# Altium schematic sheet Sheet3.SchDoc
size A; SheetNumber: 1; SheetTotal: 1
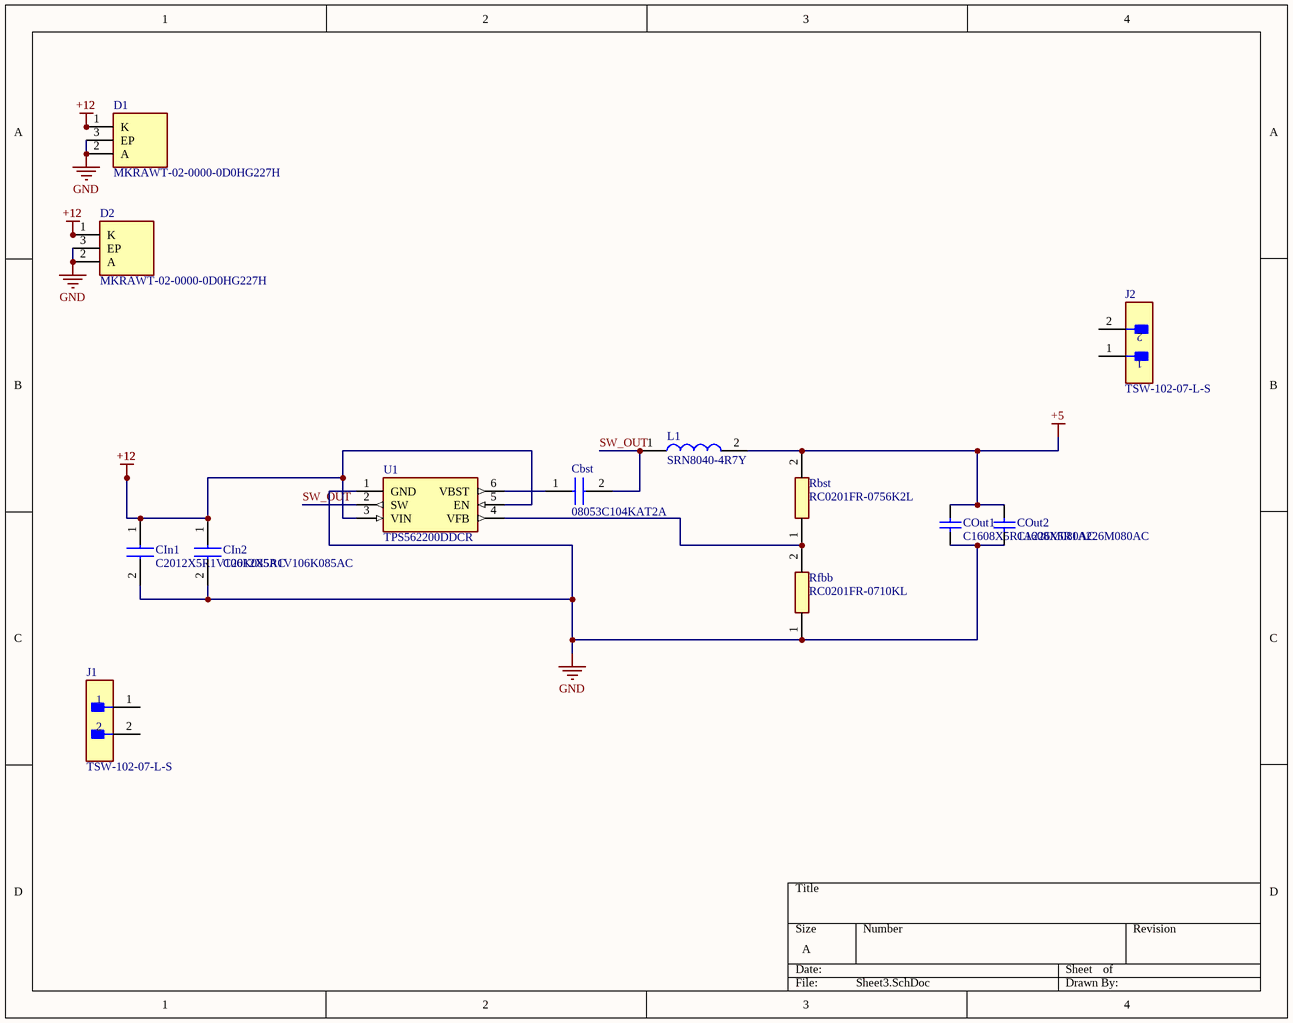
[diagram p0: Sheet3.SchDoc]

## Parts
Cbst  08053C104KAT2A  [CAPC2012X94N]
CIn1  C2012X5R1V106K085AC  [C2012_Commercial]
CIn2  C2012X5R1V106K085AC  [C2012_Commercial]
COut1  C1608X5R1A226M080AC  [CAPC1608X100X20ML10]
COut2  C1608X5R1A226M080AC  [CAPC1608X100X20ML10]
D1  MKRAWT-02-0000-0D0HG227H  [MKRAWT0200000D0HG227H]
D2  MKRAWT-02-0000-0D0HG227H  [MKRAWT0200000D0HG227H]
J1  TSW-102-07-L-S  [FP-TSW-102-07-L-S-MFG]
J2  TSW-102-07-L-S  [FP-TSW-102-07-L-S-MFG]
L1  SRN8040-4R7Y  [SRN80404R7Y]
Rbst  RC0201FR-0756K2L  [RESC0603X26N]
Rfbb  RC0201FR-0710KL  [RESC0603X26N]
U1  TPS562200DDCR  [SOT95P280X110-6N]

## Nets
+5: COut1.2 COut2.2 L1.2 Rbst.2
+12: CIn1.1 CIn2.1 D1.1(K) D2.1(K) U1.3(VIN) U1.5(EN)
GND: CIn1.2 CIn2.2 COut1.1 COut2.1 D1.2(A) D1.3(EP) D2.2(A) D2.3(EP) Rfbb.1 U1.1(GND)
SW_OUT: Cbst.2 L1.1 U1.2(SW)
NetCbst_1: Cbst.1 U1.6(VBST)
NetRbst_1: Rbst.1 Rfbb.2 U1.4(VFB)

Not connected (* = marked no-connect by the designer): J1 1 2; J2 1 2

## Library data of the parts
Cbst = 08053C104KAT2A: Capacitor; Manufacturer_Name: AVX; Datasheet Link: http://datasheets.avx.com/X7RDielectric.pdf; Height: 0.94mm; Manufacturer_Part_Number: 08053C104KAT2A; Mouser Part Number: 581-08053C104K; Mouser Price/Stock: https://www.mouser.co.uk/ProductDetail/AVX/08053C104KAT2A?qs=EihRZLdKnF2GcTBzDkE%2FiQ%3D%3D; Arrow Part Number: 08053C104KAT2A; Arrow Price/Stock: https://www.arrow.com/en/products/08053c104kat2a/avx
CIn1 CIn2 = C2012X5R1V106K085AC: Capacitor; Manufacturer_Name: TDK; Datasheet Link: https://product.tdk.com/system/files/dam/doc/product/capacitor/ceramic/mlcc/catalog/mlcc_commercial_general_en.pdf; Height: 0.75mm; Manufacturer_Part_Number: C2012X5R1V106K085AC; Mouser Part Number: 810-C2012X5R1V106K0C; Mouser Price/Stock: https://www.mouser.co.uk/ProductDetail/TDK/C2012X5R1V106K085AC?qs=6JAMGB%252BEdky%252BlYMcTLhFyA%3D%3D; Arrow Part Number: C2012X5R1V106K085AC; Arrow Price/Stock: https://www.arrow.com/en/products/c2012x5r1v106k085ac/tdk?region=nac
COut1 COut2 = CMP-2000-05441-1: Chip Capacitor, 22 uF, +/- 20%, 10 V, -55 to 85 degC, 0603 (1608 Metric), RoHS, Tape and Reel; Manufacturer: TDK; PCN Part Number: MLCCPartNumberChange30/Nov/2012; Voltage - Rated: 10V; Product Training Modules: CSeriesGeneralApplicationsSEAT,CCV,andTVCLDesignToolsGuidetoReplacinganElectrolyticCapacitorwithanMLCC; Other Names: 445-9077-1; Design Resources: 20WNon-IsolatedBuckLEDDriverUsingPLLNK460KG; Online Catalog: CSeries,GeneralPurpose; Capacitance: 22µF; Temperature Coefficient: X5R; Kits: 445-9014-KIT-ND-KITMLCC100PF-22UF060310-50V; Packaging: CutTape(CT); Standard Package: 1; Package / Case: 0603(1608Metric); Lead Style: -; Features: -; Ratings: -; Operating Temperature: -55degC~85degC; Applications: GeneralPurpose; Package Reference: 603; Datasheet URL: http://download.siliconexpert.com/pdfs/2015/4/21/15/54/45/779/tdk_/manual/37024850441143360mlcc_commercial_general_en.pdf; Datasheet Version: Mar-15; Mounting Type: SurfaceMount,MLCC; Lead Spacing: -; Size / Dimension: 0.063"Lx0.031"W(1.60mmx0.80mm); Height - Seated (Max): -; Package Description: 2-Pin Surface Mount Device, Body 1.6 x 0.8 mm; Manufacturer URL: http://www.tdk.com/; RoHS Information: RoHSCertificate-MLCC; Tolerance: ±20%; Series: C; Thickness (Max): 0.035"(0.90mm); Family: CeramicCapacitors; Category: Capacitors
D1 D2 = MKRAWT-02-0000-0D0HG227H: LED; Manufacturer_Name: CREE LED; Datasheet Link: https://assets.cree-led.com/a/ds/x/XLamp-MKR.pdf; Height: 4.21mm; Manufacturer_Part_Number: MKRAWT-02-0000-0D0HG227H; Mouser Part Number: 941-MKRAWT20D0HG227H; Mouser Price/Stock: https://www.mouser.co.uk/ProductDetail/Cree-LED/MKRAWT-02-0000-0D0HG227H?qs=sVgt%2FnWVh7apRdKowZa3kg%3D%3D
J1 J2 = CMP-02766-001428-1: CONN HEADER VERT 2POS 2.54MM; Voltage Rating: 550V; Current Rating: 7.6A; Gender: Male; Number of Contacts: 2; Connector Type: Male Pin; Radiation Hardening: No; Orientation: Straight; Contact Plating: Gold; Max Operating Temperature: 125°C; Mount: Through Hole; Package Quantity: 1; Number of Rows: 1; Housing Material: Polyester; RoHS Compliant: Yes; Length: 5.08mm; Max Voltage Rating (AC): 550V; Pitch: 2.54mm; Packaging: Bulk; Depth: 2.54mm; Termination: Solder; Min Operating Temperature: -55°C; Housing Color: Black; Lead Free: Lead Free; Color: Black; Number of Positions: 2; Width: 2.54mm; Max Current Rating: 7.6A; REACH SVHC: No SVHC; Contact Material: Bronze; Contact Mating Length: 0.23inch; Series: TSW; Contact Type: Male Pin
L1 = SRN8040-4R7Y: Inductor; Manufacturer_Name: Bourns; Datasheet Link: https://www.bourns.com/docs/Product-Datasheets/SRN8040.pdf; Height: 4mm; Manufacturer_Part_Number: SRN8040-4R7Y; Mouser Part Number: 652-SRN8040-4R7Y; Mouser Price/Stock: https://www.mouser.co.uk/ProductDetail/Bourns/SRN8040-4R7Y?qs=opBjA1TV900PE0RcT6q7Gw%3D%3D; Arrow Part Number: SRN8040-4R7Y; Arrow Price/Stock: https://www.arrow.com/en/products/srn8040-4r7y/bourns?region=nac
Rbst = RC0201FR-0756K2L: Resistor; Manufacturer_Name: KEMET; Datasheet Link: http://www.yageo.com/documents/recent/PYu-RC0201_51_RoHS_L_8.pdf; Height: 0.26mm; Manufacturer_Part_Number: RC0201FR-0756K2L; Mouser Part Number: 603-RC0201FR-0756K2L; Mouser Price/Stock: https://www.mouser.co.uk/ProductDetail/YAGEO/RC0201FR-0756K2L?qs=Q4gDqC5t5%2FD3%2Fkjmz2Nr%2Fw%3D%3D; Arrow Part Number: RC0201FR-0756K2L; Arrow Price/Stock: https://www.arrow.com/en/products/rc0201fr-0756k2l/yageo?region=nac
Rfbb = RC0201FR-0710KL: Resistor; Manufacturer_Name: YAGEO; Datasheet Link: https://www.yageo.com/upload/media/product/productsearch/datasheet/rchip/PYu-RC_Group_51_RoHS_L_12.pdf; Height: 0.26mm; Manufacturer_Part_Number: RC0201FR-0710KL; Mouser Part Number: 603-RC0201FR-0710KL; Mouser Price/Stock: https://www.mouser.co.uk/ProductDetail/YAGEO/RC0201FR-0710KL?qs=FLc6udek5PS1AiJCgpc6bQ%3D%3D; Arrow Part Number: RC0201FR-0710KL; Arrow Price/Stock: https://www.arrow.com/en/products/rc0201fr-0710kl/yageo?region=europe
U1 = TPS562200DDCR: Undefined or Miscellaneous; Manufacturer_Name: Texas Instruments; Datasheet Link: http://www.ti.com/lit/gpn/tps562200; Height: 1.1mm; Manufacturer_Part_Number: TPS562200DDCR; Mouser Part Number: 595-TPS562200DDCR; Mouser Price/Stock: https://www.mouser.co.uk/ProductDetail/Texas-Instruments/TPS562200DDCR?qs=7wMBv%2Ftbz9Jdis0htpD4wA%3D%3D; Arrow Part Number: TPS562200DDCR; Arrow Price/Stock: https://www.arrow.com/en/products/tps562200ddcr/texas-instruments?region=nac